# Altium schematic sheet System.SchDoc
size A4
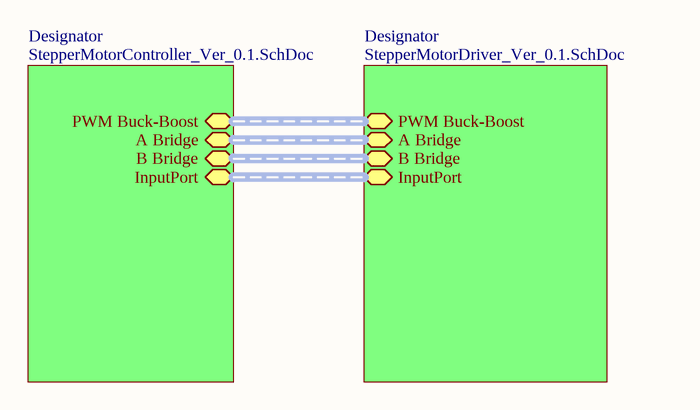
[diagram p0: System.SchDoc]

## Sub-sheets
Designator = StepperMotorController_Ver_0.1.SchDoc: InputPort (harness InputPort), PWM Buck-Boost (harness PWM Buck-Boost), A Bridge (harness A Bridge Sensors), B Bridge (harness B Bridge Sensors)
Designator = StepperMotorDriver_Ver_0.1.SchDoc: PWM Buck-Boost (harness PWM Buck-Boost), A Bridge (harness A Bridge Sensors), B Bridge (harness B Bridge Sensors), InputPort (harness InputPort)